# Altium schematic sheet MB1-LED_BUTTON.SchDoc: Leds & Buttons
size A; Author: Nguyen Van Hien; DrawnBy: MBoard team; DocumentNumber: 7; Revision: 1.1; SheetNumber: 7; SheetTotal: 7; DocumentName: LED_BUTTON
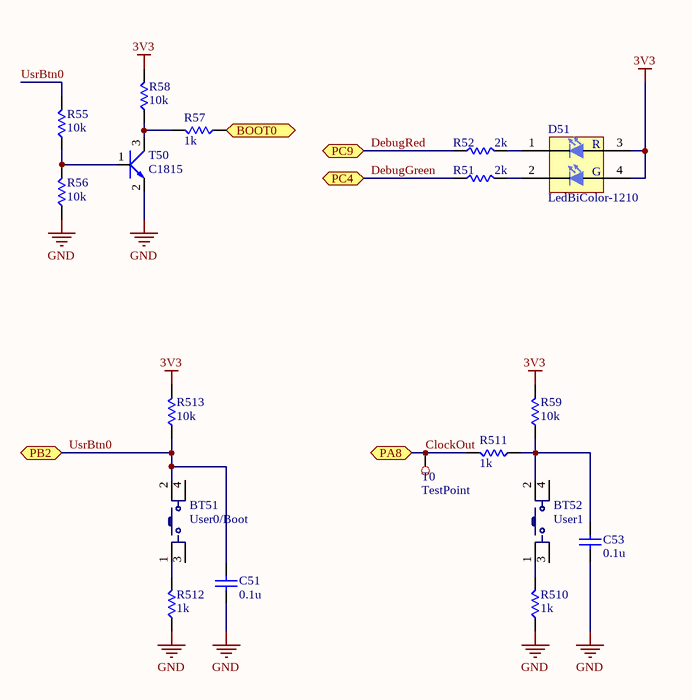
[diagram p0: MB1-LED_BUTTON.SchDoc]

## Parts
BT51  User0/Boot  [Horizon_SW_4pin_rectangular]
BT52  User1  [Horizon_SW_4pin_rectangular]
C51  value 0.1u  [SM_0805_LD]  (hidden comment: CAP_Ceramic)
C53  value 0.1u  [SM_0805_LD]  (hidden comment: CAP_Ceramic)
D51  LedBiColor-1210  [Led-BiColor]
R51  value 2k  [SM_0805_LD]
R52  value 2k  [SM_0805_LD]
R55  value 10k  [SM_0805_LD]
R56  value 10k  [SM_0805_LD]
R57  value 1k  [SM_0805_LD]
R58  value 10k  [SM_0805_LD]
R59  value 10k  [SM_0805_LD]
R510  value 1k  [SM_0805_LD]
R511  value 1k  [SM_0805_LD]
R512  value 1k  [SM_0805_LD]
R513  value 10k  [SM_0805_LD]
T0  TestPoint  [TestPoint]
T50  C1815  [SOT23]

## Ports
BOOT0 (bidir), PA8 (bidir), PB2 (bidir), PC4 (bidir), PC9 (bidir)

## Nets
3V3: D51.3(R+) D51.4(G+) R58.2 R59.2 R513.2
GND: C51.1 C53.1 R56.1 R510.1 R512.1 T50.2(E)
BOOT0: R57.1 ; port BOOT0
ClockOut: R511.2 T0.1 ; port PA8
DebugGreen: R51.1 ; port PC4
DebugRed: R52.1 ; port PC9
UsrBtn0: BT51.2 C51.2 R55.2 R513.1 ; port PB2
NetBT51_1: BT51.1 R512.2
NetBT52_1: BT52.1 R510.2
NetBT52_2: BT52.2 C53.2 R59.1 R511.1
NetD51_1: D51.1(R-) R52.2
NetD51_2: D51.2(G-) R51.2
NetR55_1: R55.1 R56.2 T50.1(B)
NetR57_2: R57.2 R58.1 T50.3(C)

Not connected (* = marked no-connect by the designer): BT51 3 4; BT52 3 4

## Notes on the sheet
- (in symbol LedBiColor-1210) R; G

## Library data of the parts
BT51 BT52 = Button: Tact switch
C51 C53 = C_Ceramic: Non-polarity ceramic capacitor; Published: 8-Jun-2000; LatestRevisionDate: 17-Jul-2002; LatestRevisionNote: Re-released for DXP Platform.; PackageReference: RAD-0.3; Publisher: Altium Limited; PackageDescription: Radial Cap, Thru-Hole; 2 Leads; 0.3 in Pin Spacing
R51 R52 R55-R59 R510-R513 = R: Resistor; Published: 8-Jun-2000; LatestRevisionDate: 29-May-2009; LatestRevisionNote: IPC-7351 Footprint Added.; PackageReference: J1-0603; Publisher: Altium Limited; PackageDescription: Chip Resistor